# EAGLE design example (EAGLE 9.2.1)
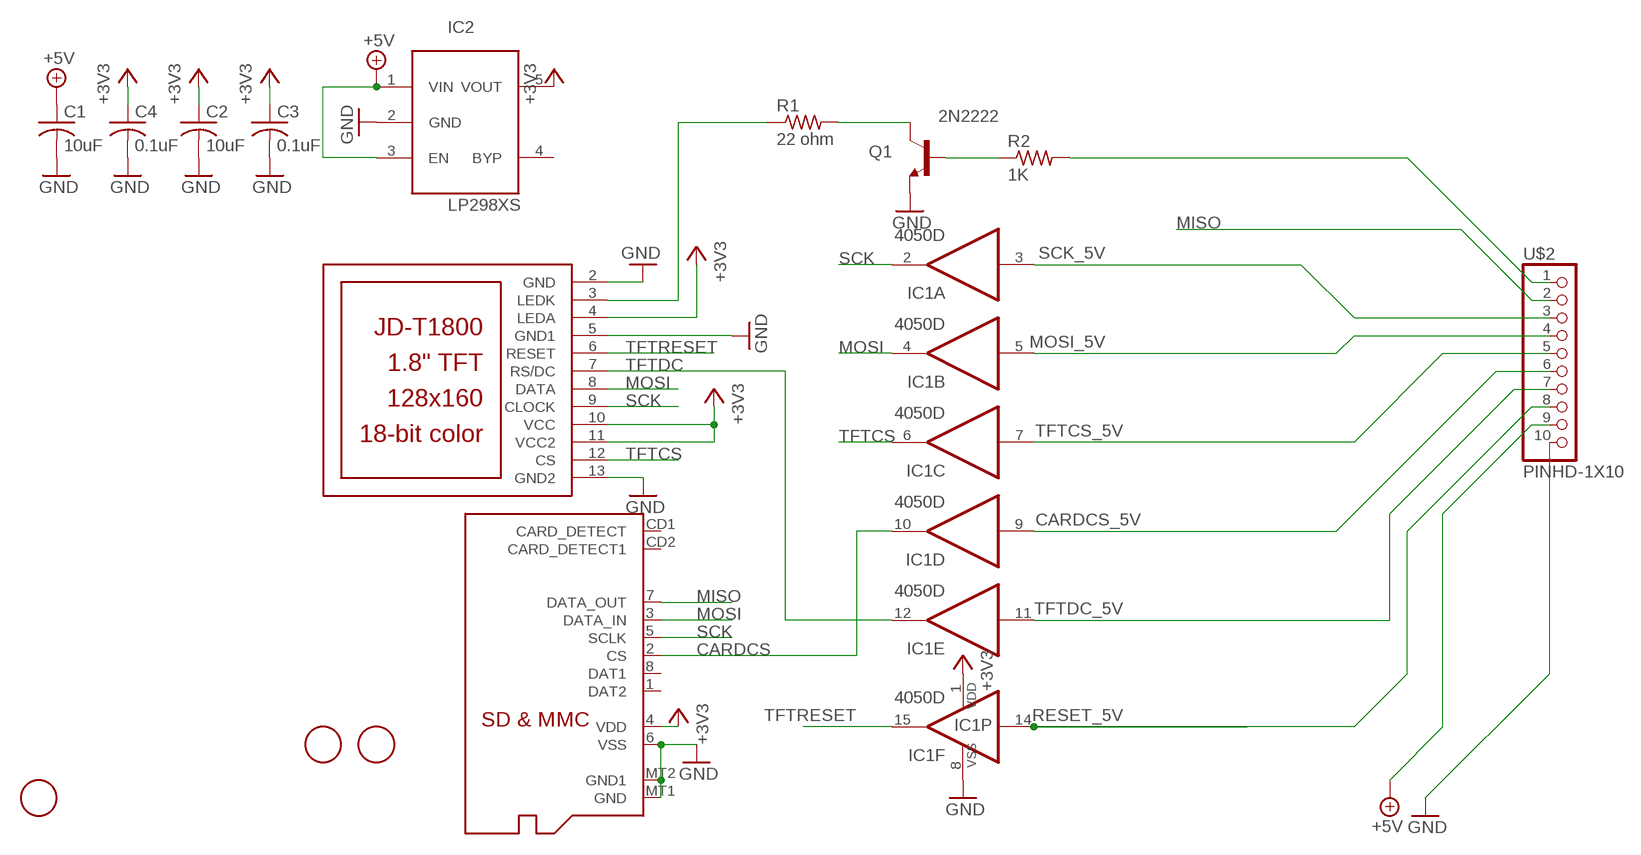
[diagram p0: schematic, sheet 1]

## Parts
C1  10uF  C-USC0805K  [C0805K]
C2  10uF  C-USC0805K  [C0805K]
C3  0.1uF  C-USC0805K  [C0805K]
C4  0.1uF  C-USC0805K  [C0805K]
IC1  4050D  [SO16]
IC2  LP298XS  [SOT23-5L]
Q1  2N2222  MMBT2222ALT1-NPN-SOT23-BEC  [SOT23-BEC]
Q2  MICROSD  [MICROSD]
R1  22 ohm  R-US_R0805  [R0805]
R2  1K  R-US_R0805  [R0805]
U$1  JD-T1800  [JD-T1800]
U$2  PINHD-1X10  [1X10-BIG]
U$3  FIDUCIAL  [FIDUCIAL_1MM]
U$4  FIDUCIAL  [FIDUCIAL_1MM]
U$5  FIDUCIAL  [FIDUCIAL_1MM]

## Nets
+3V3 [power]: C2.1 C3.1 C4.1 IC1.1(P:VDD) IC2.5(VOUT) Q2.4(VDD) U$1.4(LEDA) U$1.10(VCC) U$1.11(VCC2)
+5V [power]: C1.1 IC2.1(VIN) IC2.3(EN) U$2.9
CARDCS: IC1.10(D:O) Q2.2(CS)
CARDCS_5V: IC1.9(D:I) U$2.6
GND: C1.2 C2.2 C3.2 C4.2 IC1.8(P:VSS) IC2.2(GND) Q1.E Q2.6(VSS) Q2.MT1(GND) Q2.MT2(GND1) U$1.2(GND) U$1.5(GND1) U$1.13(GND2) U$2.10
MISO: Q2.7(DATA_OUT) U$2.2
MOSI: IC1.4(B:O) Q2.3(DATA_IN) U$1.8(DATA)
MOSI_5V: IC1.5(B:I) U$2.4
N$1: Q1.B R2.1
N$4: R1.1 U$1.3(LEDK)
N$5: Q1.C R1.2
N$6: R2.2 U$2.1
RESET_5V: IC1.14(F:I) U$2.8
SCK: IC1.2(A:O) Q2.5(SCLK) U$1.9(CLOCK)
SCK_5V: IC1.3(A:I) U$2.3
TFTCS: IC1.6(C:O) U$1.12(CS)
TFTCS_5V: IC1.7(C:I) U$2.5
TFTDC: IC1.12(E:O) U$1.7(RS/DC)
TFTDC_5V: IC1.11(E:I) U$2.7
TFTRESET: IC1.15(F:O) U$1.6(RESET)
Unconnected: IC2.4(BYP) Q2.1(DAT2) Q2.8(DAT1) Q2.CD1(CARD_DETECT) Q2.CD2(CARD_DETECT1)

## Library data of the parts
C1-C4 = rcl:C-US: CAPACITOR, American symbol
IC1 = 40xx:4050: Hex non-inverting BUFFER
IC2 = adafruit:LP298X
Q1 = transistor:*-NPN-: NPN Transistror BF959 corrected 2008.03.06
Q2 = adafruit:MICROSD: Micro-SD / Transflash card holder with SPI pinout For the 3M # 2908-05WB-MG and/or 4UCON #19656 push-push type
R1 R2 = adafruit:R-US_: RESISTOR, American symbol
U$1 = adafruit:JD-T1800
U$2 = adafruit:PINHD-1X10: Pin header 1x10 0.1" spacing With round pins
U$3-U$5 = adafruit:FIDUCIAL: For use by pick and place machines to calibrate the vision/machine, 1mm By microbuilder.eu

## Net classes
1 power: width 0.406 mm

## Board
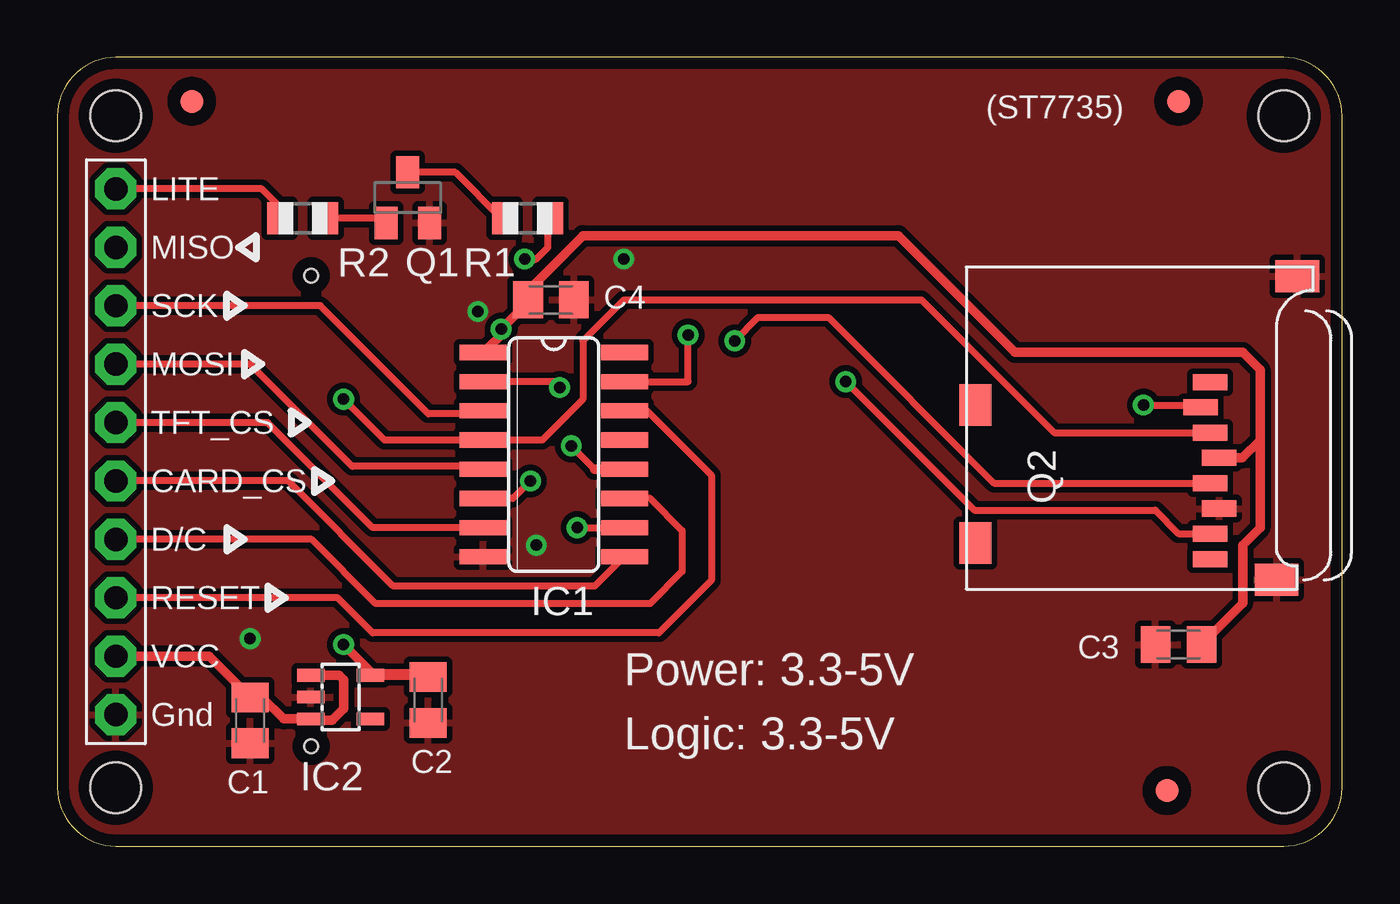
[diagram p1: board, top side]
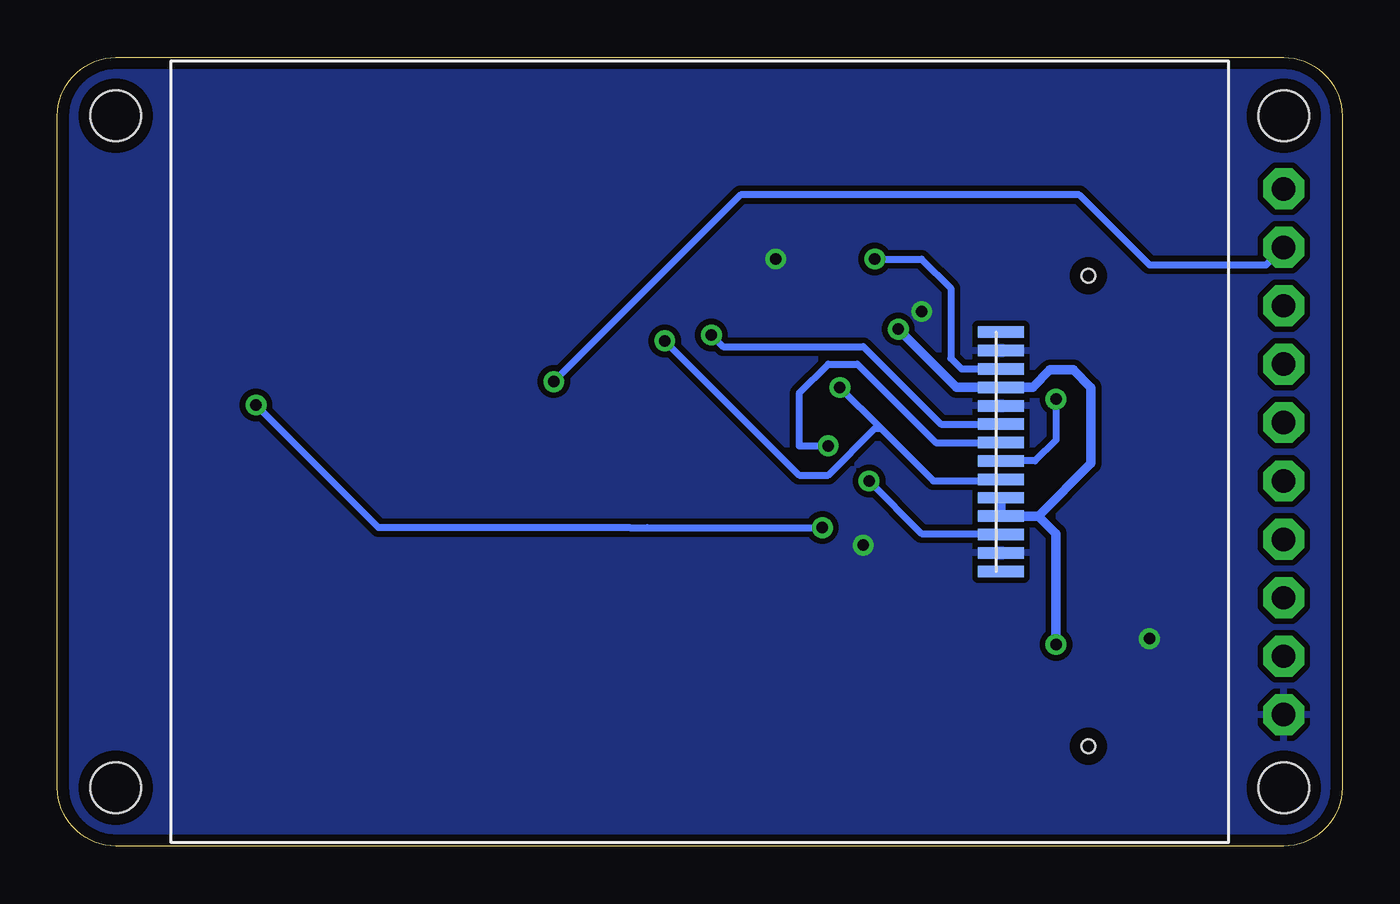
[diagram p2: board, bottom side, seen from below]

Size 55.88 x 34.29 mm. Coordinates in mm from the lower left corner, seen from the top.
Outline: 2.54,34.29 arc90 0,31.75 0,2.54 arc90 2.54,0 53.34,0 arc90 55.88,2.54 55.88,31.75 arc90 53.34,34.29 2.54,34.29
Copper layers (1*16): Top 0.035mm / dielectric 1.5mm / Bottom 0.035mm
Design rules "default *": minimum track width 10mil, minimum drill 14mil, track to track 10mil, track to pad 10mil, pad to pad 10mil, via to via 10mil, smd to smd 8mil, copper to edge 20mil, drill to drill 8mil, minimum pad ring 10mil, minimum via ring 8mil, stop-mask expansion 4mil, vias tented up to drill 20mil, thermal gap 10mil
Holes 2.2 mm at 2.54,31.75 2.54,2.54 53.34,2.54 53.34,31.75

### Footprints (pad centres in the part's own frame; a part is rotated, then mirrored left to right if it is on the bottom)
C0805K = smd 1.3 x 1.6: 1 -1,0; 2 1,0
SO16 = smd 0.66 x 2.032: 1 -4.445,-3.073; 2 -3.175,-3.073; 3 -1.905,-3.073; 4 -0.635,-3.073; 5 0.635,-3.073; 6 1.905,-3.073; 7 3.175,-3.073; 8 4.445,-3.073; 9 4.445,3.073; 10 3.175,3.073; 11 1.905,3.073; 12 0.635,3.073; 13 -0.635,3.073; 14 -1.905,3.073; 15 -3.175,3.073; 16 -4.445,3.073
SOT23-5L = smd 0.55 x 1.2: 1 -0.95,-1.3; 2 0,-1.3; 3 0.95,-1.3; 4 0.95,1.3; 5 -0.95,1.3
SOT23-BEC = smd 1 x 1.4: B -0.95,-1.1; C 0,1.1; E 0.95,-1.1
MICROSD = smd 0.7 x 1.5: 1 9,-10.64; 2 7.9,-10.24; 3 6.8,-10.64; 4 5.7,-11.04; 5 4.6,-10.64; 6 3.5,-11.04; 7 2.4,-10.64; 8 1.3,-10.64 | smd 1.8 x 1.4: CD1 2,-0.44; CD2 8,-0.44 | smd 1.4 x 1.9: MT1 0.4,-13.54; MT2 13.6,-14.44
R0805 = smd 1.1 x 1.4: 1 -1,0; 2 1,0
JD-T1800 = smd 0.5 x 2: 1 5.2,-13.1; 2 4.4,-13.1; 3 3.6,-13.1; 4 2.8,-13.1; 5 2,-13.1; 6 1.2,-13.1; 7 0.4,-13.1; 8 -0.4,-13.1; 9 -1.2,-13.1; 10 -2,-13.1; 11 -2.8,-13.1; 12 -3.6,-13.1; 13 -4.4,-13.1; 14 -5.2,-13.1 | hole 0.6: -12.8,-16.9; 7.65,-16.9
1X10-BIG = drill 1.016 pad 1.778 octagon: 1 -11.43,0; 2 -8.89,0; 3 -6.35,0; 4 -3.81,0; 5 -1.27,0; 6 1.27,0; 7 3.81,0; 8 6.35,0; 9 8.89,0; 10 11.43,0
FIDUCIAL_1MM = smd 1 x 1: 1 0,0

### Placement (x,y rotation side)
C1  8.38,5.46 270 top
C2  16.13,6.35 270 top
C3  48.77,8.76 180 top
C4  21.46,23.75 0 top
IC1  21.59,17.02 270 top
IC2  12.32,6.48 270 top
Q1  15.24,28.19 0 top
Q2  39.5,11.18 90 top
R1  20.45,27.3 180 top
R2  10.67,27.3 180 top
U$1  27.94,17.14 90 bottom
U$2  2.54,17.14 270 top
U$3  48.26,2.41 0 top
U$4  5.84,32.38 0 top
U$5  48.77,32.38 0 top

### Tracks (layer width: path | path; a pad name or v marks a point on that pad's centre or on a via)
+3V3  (via drill 0.5)
  Top 0.406: 16.19,7.43 C2.1 | 16.19,7.43 IC2.5 | 16.19,7.43 16.26,7.49 13.72,7.49 v12.45,8.76 | IC1.1 18.54,21.46 19.56,22.48 v19.3,22.48 20.32,23.49 20.32,23.75 C4.1 20.57,23.75 20.57,24.26 22.86,26.54 36.58,26.54 41.66,21.46 51.56,21.46 52.32,20.7 52.32,17.65 | Q2.4 51.55,16.88 52.32,17.65 | C3.1 51.56,10.56 51.56,13.08 52.32,13.84 52.32,17.65
  Bottom 0.406: v12.45,8.76 12.45,13.59 13.21,14.35 | 13.21,14.35 14.73,14.35 | 14.73,14.35 14.74,14.34 U$1.11 | U$1.10 14.84,14.46 14.73,14.35 | 13.21,14.35 10.92,16.64 10.92,19.94 11.68,20.7 12.7,20.7 13.46,19.95 U$1.4 16.77,19.95 v19.3,22.48
+5V
  Top 0.406: U$2.9 6.6,8.25 8.38,6.48 C1.1 8.38,6.22 8.64,6.48 8.89,6.48 9.84,5.53 IC2.3 11.11,5.53 11.18,5.46 11.94,5.46 12.45,5.97 12.45,7.24 12.26,7.43 IC2.1
CARDCS  (via drill 0.5)
  Top 0.305: v22.61,13.84 IC1.10 | Q2.2 49.74,19.13 49.78,19.18 v47.24,19.18
  Bottom 0.305: v22.61,13.84 30.23,13.84 30.99,13.84 41.91,13.84 v47.24,19.18
CARDCS_5V
  Top 0.305: U$2.6 10.03,15.88 14.61,11.3 23.37,11.3 24.64,12.57 IC1.9
GND  (via drill 0.5)
  other vias: 18.29,23.24 24.64,25.53 8.38,9.02 20.83,13.08
  pour Top: 0,-0.64 0,34.92 55.88,34.92 55.88,-0.64
  pour Bottom: 0,-0.64 0,34.92 55.88,34.92 55.88,-0.64
MISO  (via drill 0.5)
  Top 0.305: Q2.7 50.28,13.58 50.29,13.59 48.77,13.59 47.75,14.61 39.88,14.61 v34.29,20.19
  Bottom 0.305: U$2.2 3.3,25.27 8.38,25.27 11.43,28.32 26.16,28.32 v34.29,20.19
MOSI  (via drill 0.5)
  Top 0.305: IC1.4 18.54,17.65 | v12.45,19.43 14.22,17.65 IC1.4 | IC1.4 21.08,17.65 22.86,19.43 22.86,21.97 24.64,23.75 37.59,23.75 43.37,17.98 Q2.3
  Bottom 0.305: U$1.8 13.35,16.75 12.45,17.65 v12.45,19.43
MOSI_5V
  Top 0.305: U$2.4 8.38,20.95 12.83,16.51 18.54,16.51 18.67,16.38 IC1.5
N$1
  Top 0.305: 14.44,27.09 14.48,27.05 | 14.44,27.09 Q1.B | R2.1 14.22,27.3 14.44,27.09
N$4  (via drill 0.5)
  Top 0.305: R1.1 21.34,27.3 21.34,26.04 20.83,25.53 v20.32,25.53
  Bottom 0.305: U$1.3 16.55,20.75 17.02,21.21 17.02,24.26 18.29,25.53 v20.32,25.53
N$5
  Top 0.305: R1.2 19.3,27.3 17.32,29.29 Q1.C
N$6
  Top 0.305: U$2.1 8.89,28.57 9.91,27.56 9.65,27.3 R2.2
RESET_5V
  Top 0.305: U$2.8 12.19,10.79 13.72,9.27 26.16,9.27 28.45,11.56 28.45,16.13 25.65,18.92 IC1.14 24.64,18.92
SCK  (via drill 0.5)
  Top 0.305: IC1.2 21.59,20.19 v21.84,19.94 | Q2.5 40.74,15.78 33.53,22.99 30.48,22.99 v29.46,21.97
  Bottom 0.305: U$1.9 14.91,15.88 17.78,15.88 20.07,18.16 | 20.07,18.16 v21.84,19.94 | 20.07,18.16 20.32,18.16 22.35,16.13 23.62,16.13 v29.46,21.97
SCK_5V
  Top 0.305: U$2.3 11.43,23.49 16.13,18.8 18.64,18.8 | 18.64,18.8 18.67,18.8 | IC1.3 18.64,18.8
TFTCS  (via drill 0.5)
  Top 0.305: IC1.6 19.81,15.11 v20.57,15.88
  Bottom 0.305: U$1.12 14.88,13.59 18.29,13.59 v20.57,15.88
TFTCS_5V
  Top 0.305: U$2.5 9.14,18.41 13.72,13.84 18.54,13.84 | IC1.7 18.54,13.84 | 18.54,13.84 18.67,13.72
TFTDC  (via drill 0.5)
  Top 0.305: v22.35,17.4 23.37,16.38
  Top 0.406: 23.37,16.38 IC1.12
  Bottom 0.305: v22.35,17.4 23.62,17.4 23.62,19.68 22.35,20.95 21.08,20.95 17.67,17.54 U$1.7
TFTDC_5V
  Top 0.305: U$2.7 11.05,13.33 13.84,10.54 25.78,10.54 27.18,11.94 27.18,13.72 25.78,15.11 IC1.11
TFTRESET  (via drill 0.5)
  Top 0.305: 24.89,20.19 IC1.15 27.43,20.19 v27.43,22.23
  Bottom 0.305: U$1.6 17.46,18.34 20.83,21.72 26.92,21.72 v27.43,22.23

### Text on the board
tPlace: (ST7735) | LITE | MISO | SCK | MOSI | TFT_CS | CARD_CS | D/C | RESET | VCC | Power: 3.3-5V | Gnd | Logic: 3.3-5V